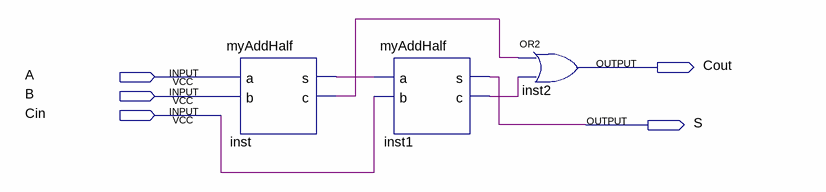
[diagram p0: schematic sheet]
// Quartus schematic myAddFull.bdf as structural Verilog: 3 symbols, 5 pins
module myAddFull (
  input  A,
  input  B,
  input  Cin,
  output Cout,
  output S
);

  wire inst1_c, inst_c, inst_s;

  myAddHalf inst (.a(A), .b(B), .s(inst_s), .c(inst_c));
  myAddHalf inst1 (.a(inst_s), .b(Cin), .s(S), .c(inst1_c));
  or inst2 (Cout, inst_c, inst1_c);
endmodule
